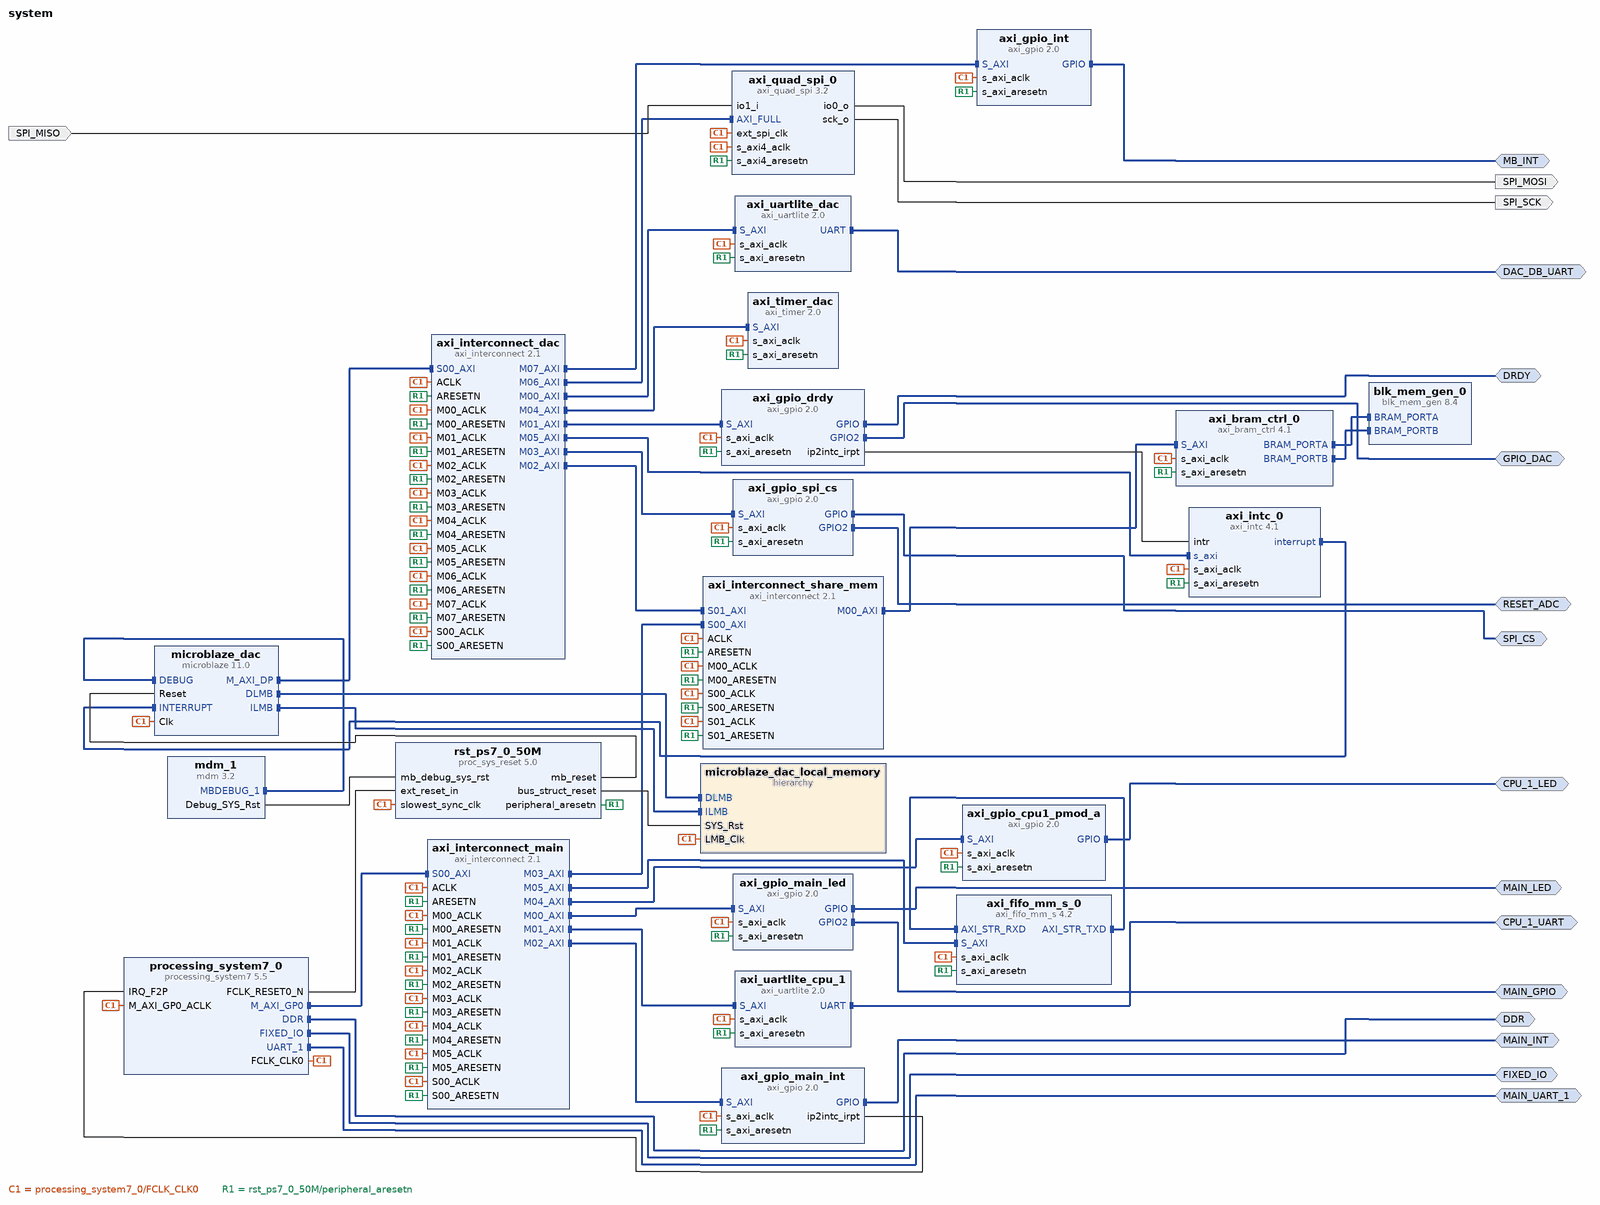
[diagram p0: block diagram of the top level]
# Vivado block design system, xc7z020clg400-1, Vivado 2022.1
create_bd_design system

create_bd_intf_port -mode Master -vlnv xilinx.com:interface:ddrx_rtl:1.0 DDR
create_bd_intf_port -mode Master -vlnv xilinx.com:display_processing_system7:fixedio_rtl:1.0 FIXED_IO
create_bd_intf_port -mode Master -vlnv xilinx.com:interface:gpio_rtl:1.0 MAIN_LED
create_bd_intf_port -mode Master -vlnv xilinx.com:interface:uart_rtl:1.0 CPU_1_UART
create_bd_intf_port -mode Master -vlnv xilinx.com:interface:uart_rtl:1.0 DAC_DB_UART
create_bd_intf_port -mode Master -vlnv xilinx.com:interface:gpio_rtl:1.0 RESET_ADC
create_bd_intf_port -mode Master -vlnv xilinx.com:interface:gpio_rtl:1.0 GPIO_DAC
create_bd_intf_port -mode Master -vlnv xilinx.com:interface:uart_rtl:1.0 MAIN_UART_1
create_bd_intf_port -mode Master -vlnv xilinx.com:interface:gpio_rtl:1.0 MAIN_GPIO
create_bd_intf_port -mode Master -vlnv xilinx.com:interface:gpio_rtl:1.0 CPU_1_LED
create_bd_intf_port -mode Master -vlnv xilinx.com:interface:gpio_rtl:1.0 SPI_CS
create_bd_intf_port -mode Master -vlnv xilinx.com:interface:gpio_rtl:1.0 DRDY
create_bd_intf_port -mode Master -vlnv xilinx.com:interface:gpio_rtl:1.0 MB_INT
create_bd_intf_port -mode Master -vlnv xilinx.com:interface:gpio_rtl:1.0 MAIN_INT
create_bd_port -dir I SPI_MISO
create_bd_port -dir O SPI_MOSI
create_bd_port -dir O SPI_SCK

create_bd_cell -type ip -vlnv xilinx.com:ip:processing_system7:5.5 processing_system7_0
set_property -dict [list \
  CONFIG.PCW_APU_PERIPHERAL_FREQMHZ 650 \
  CONFIG.PCW_CRYSTAL_PERIPHERAL_FREQMHZ 50 \
  CONFIG.PCW_ENET0_ENET0_IO {MIO 16 .. 27} \
  CONFIG.PCW_ENET0_GRP_MDIO_ENABLE 1 \
  CONFIG.PCW_ENET0_GRP_MDIO_IO {MIO 52 .. 53} \
  CONFIG.PCW_ENET0_PERIPHERAL_ENABLE 1 \
  CONFIG.PCW_EN_CLK1_PORT 1 \
  CONFIG.PCW_FCLK_CLK1_BUF TRUE \
  CONFIG.PCW_FPGA0_PERIPHERAL_FREQMHZ 100 \
  CONFIG.PCW_FPGA1_PERIPHERAL_FREQMHZ 10 \
  CONFIG.PCW_FPGA_FCLK1_ENABLE 1 \
  CONFIG.PCW_IRQ_F2P_INTR 1 \
  CONFIG.PCW_PRESET_BANK1_VOLTAGE {LVCMOS 1.8V} \
  CONFIG.PCW_QSPI_PERIPHERAL_ENABLE 0 \
  CONFIG.PCW_SD0_GRP_CD_ENABLE 1 \
  CONFIG.PCW_SD0_GRP_CD_IO {MIO 47} \
  CONFIG.PCW_SD0_GRP_WP_ENABLE 0 \
  CONFIG.PCW_SD0_PERIPHERAL_ENABLE 1 \
  CONFIG.PCW_SD0_SD0_IO {MIO 40 .. 45} \
  CONFIG.PCW_SDIO_PERIPHERAL_FREQMHZ 50 \
  CONFIG.PCW_UART0_BAUD_RATE 921600 \
  CONFIG.PCW_UART0_PERIPHERAL_ENABLE 1 \
  CONFIG.PCW_UART0_UART0_IO {MIO 14 .. 15} \
  CONFIG.PCW_UART1_BAUD_RATE 921600 \
  CONFIG.PCW_UART1_PERIPHERAL_ENABLE 1 \
  CONFIG.PCW_UART1_UART1_IO EMIO \
  CONFIG.PCW_UART_PERIPHERAL_FREQMHZ 100 \
  CONFIG.PCW_UIPARAM_DDR_BUS_WIDTH {16 Bit} \
  CONFIG.PCW_UIPARAM_DDR_FREQ_MHZ 525 \
  CONFIG.PCW_UIPARAM_DDR_PARTNO Custom \
  CONFIG.PCW_USE_FABRIC_INTERRUPT 1 \
] [get_bd_cells processing_system7_0]
# 146 more settings of processing_system7_0 are not shown: defaults, MIO pin electricals, DDR timing, and values the tool derives
create_bd_cell -type ip -vlnv xilinx.com:ip:proc_sys_reset:5.0 rst_ps7_0_50M
create_bd_cell -type ip -vlnv xilinx.com:ip:mdm:3.2 mdm_1
set_property -dict {CONFIG.C_ADDR_SIZE 32 CONFIG.C_MB_DBG_PORTS 3 CONFIG.C_M_AXI_ADDR_WIDTH 32} [get_bd_cells mdm_1]
create_bd_cell -type ip -vlnv xilinx.com:ip:axi_gpio:2.0 axi_gpio_main_led
set_property -dict [list \
  CONFIG.C_ALL_INPUTS_2 0 \
  CONFIG.C_ALL_OUTPUTS 1 \
  CONFIG.C_ALL_OUTPUTS_2 1 \
  CONFIG.C_GPIO2_WIDTH 1 \
  CONFIG.C_GPIO_WIDTH 1 \
  CONFIG.C_INTERRUPT_PRESENT 0 \
  CONFIG.C_IS_DUAL 1 \
] [get_bd_cells axi_gpio_main_led]
create_bd_cell -type ip -vlnv xilinx.com:ip:axi_interconnect:2.1 axi_interconnect_main
set_property -dict {CONFIG.NUM_MI 6 CONFIG.NUM_SI 1} [get_bd_cells axi_interconnect_main]
create_bd_cell -type ip -vlnv xilinx.com:ip:axi_gpio:2.0 axi_gpio_spi_cs
set_property -dict [list \
  CONFIG.C_ALL_INPUTS_2 0 \
  CONFIG.C_ALL_OUTPUTS 1 \
  CONFIG.C_ALL_OUTPUTS_2 1 \
  CONFIG.C_GPIO2_WIDTH 1 \
  CONFIG.C_GPIO_WIDTH 1 \
  CONFIG.C_INTERRUPT_PRESENT 0 \
  CONFIG.C_IS_DUAL 1 \
] [get_bd_cells axi_gpio_spi_cs]
create_bd_cell -type ip -vlnv xilinx.com:ip:axi_uartlite:2.0 axi_uartlite_cpu_1
set_property -dict {CONFIG.C_BAUDRATE 115200} [get_bd_cells axi_uartlite_cpu_1]
create_bd_cell -type ip -vlnv xilinx.com:ip:axi_bram_ctrl:4.1 axi_bram_ctrl_0
set_property -dict {CONFIG.SINGLE_PORT_BRAM 0} [get_bd_cells axi_bram_ctrl_0]
create_bd_cell -type ip -vlnv xilinx.com:ip:blk_mem_gen:8.4 blk_mem_gen_0
set_property -dict {CONFIG.Memory_Type True_Dual_Port_RAM} [get_bd_cells blk_mem_gen_0]
create_bd_cell -type ip -vlnv xilinx.com:ip:axi_interconnect:2.1 axi_interconnect_share_mem
set_property -dict {CONFIG.NUM_MI 1 CONFIG.NUM_SI 2} [get_bd_cells axi_interconnect_share_mem]
create_bd_cell -type ip -vlnv xilinx.com:ip:microblaze:11.0 microblaze_dac
set_property -dict [list \
  CONFIG.C_DEBUG_ENABLED 1 \
  CONFIG.C_D_AXI 1 \
  CONFIG.C_D_LMB 1 \
  CONFIG.C_ENABLE_DISCRETE_PORTS 0 \
  CONFIG.C_FSL_LINKS 0 \
  CONFIG.C_I_LMB 1 \
] [get_bd_cells microblaze_dac]
create_bd_cell -type hier microblaze_dac_local_memory
create_bd_cell -type ip -vlnv xilinx.com:ip:axi_interconnect:2.1 axi_interconnect_dac
set_property -dict {CONFIG.NUM_MI 8} [get_bd_cells axi_interconnect_dac]
create_bd_cell -type ip -vlnv xilinx.com:ip:axi_uartlite:2.0 axi_uartlite_dac
set_property -dict {CONFIG.C_BAUDRATE 115200} [get_bd_cells axi_uartlite_dac]
create_bd_cell -type ip -vlnv xilinx.com:ip:axi_gpio:2.0 axi_gpio_drdy
set_property -dict [list \
  CONFIG.C_ALL_INPUTS 1 \
  CONFIG.C_ALL_OUTPUTS_2 1 \
  CONFIG.C_GPIO2_WIDTH 1 \
  CONFIG.C_GPIO_WIDTH 1 \
  CONFIG.C_INTERRUPT_PRESENT 1 \
  CONFIG.C_IS_DUAL 1 \
] [get_bd_cells axi_gpio_drdy]
create_bd_cell -type ip -vlnv xilinx.com:ip:axi_timer:2.0 axi_timer_dac
create_bd_cell -type ip -vlnv xilinx.com:ip:axi_intc:4.1 axi_intc_0
create_bd_cell -type ip -vlnv xilinx.com:ip:axi_gpio:2.0 axi_gpio_main_int
set_property -dict [list \
  CONFIG.C_ALL_INPUTS 1 \
  CONFIG.C_GPIO_WIDTH 1 \
  CONFIG.C_INTERRUPT_PRESENT 1 \
  CONFIG.C_IS_DUAL 0 \
] [get_bd_cells axi_gpio_main_int]
create_bd_cell -type ip -vlnv xilinx.com:ip:axi_fifo_mm_s:4.2 axi_fifo_mm_s_0
set_property -dict [list \
  CONFIG.C_RX_FIFO_DEPTH 65536 \
  CONFIG.C_RX_FIFO_PE_THRESHOLD 5 \
  CONFIG.C_RX_FIFO_PF_THRESHOLD 507 \
  CONFIG.C_TX_FIFO_DEPTH 512 \
  CONFIG.C_TX_FIFO_PE_THRESHOLD 5 \
  CONFIG.C_TX_FIFO_PF_THRESHOLD 507 \
  CONFIG.C_USE_TX_CTRL 0 \
  CONFIG.C_USE_TX_DATA 1 \
] [get_bd_cells axi_fifo_mm_s_0]
create_bd_cell -type ip -vlnv xilinx.com:ip:axi_gpio:2.0 axi_gpio_cpu1_pmod_a
set_property -dict {CONFIG.C_GPIO_WIDTH 1 CONFIG.C_IS_DUAL 0} [get_bd_cells axi_gpio_cpu1_pmod_a]
create_bd_cell -type ip -vlnv xilinx.com:ip:axi_quad_spi:3.2 axi_quad_spi_0
set_property -dict [list \
  CONFIG.C_FIFO_DEPTH 256 \
  CONFIG.C_SCK_RATIO 16 \
  CONFIG.C_TYPE_OF_AXI4_INTERFACE 1 \
  CONFIG.C_USE_STARTUP 0 \
  CONFIG.FIFO_INCLUDED 1 \
] [get_bd_cells axi_quad_spi_0]
create_bd_cell -type ip -vlnv xilinx.com:ip:axi_gpio:2.0 axi_gpio_int
set_property -dict {CONFIG.C_ALL_OUTPUTS 1 CONFIG.C_GPIO_WIDTH 1} [get_bd_cells axi_gpio_int]

# ---- hierarchy /microblaze_dac_local_memory ----
current_bd_instance /microblaze_dac_local_memory
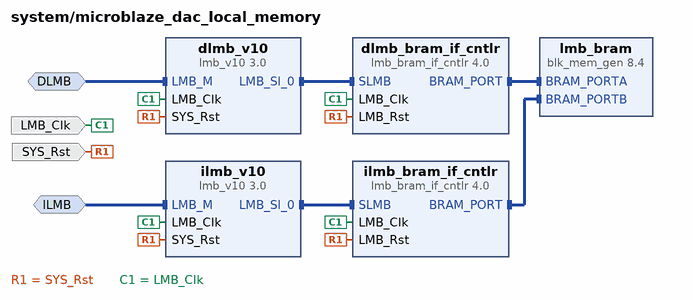
[diagram p1: block diagram inside /microblaze_dac_local_memory]
create_bd_intf_pin -mode MirroredMaster -vlnv xilinx.com:interface:lmb_rtl:1.0 DLMB
create_bd_intf_pin -mode MirroredMaster -vlnv xilinx.com:interface:lmb_rtl:1.0 ILMB
create_bd_pin -dir I -type clk LMB_Clk
create_bd_pin -dir I -type rst SYS_Rst

create_bd_cell -type ip -vlnv xilinx.com:ip:lmb_v10:3.0 dlmb_v10
create_bd_cell -type ip -vlnv xilinx.com:ip:lmb_v10:3.0 ilmb_v10
create_bd_cell -type ip -vlnv xilinx.com:ip:lmb_bram_if_cntlr:4.0 dlmb_bram_if_cntlr
set_property -dict {CONFIG.C_ECC 0} [get_bd_cells dlmb_bram_if_cntlr]
create_bd_cell -type ip -vlnv xilinx.com:ip:lmb_bram_if_cntlr:4.0 ilmb_bram_if_cntlr
set_property -dict {CONFIG.C_ECC 0} [get_bd_cells ilmb_bram_if_cntlr]
create_bd_cell -type ip -vlnv xilinx.com:ip:blk_mem_gen:8.4 lmb_bram
set_property -dict {CONFIG.Memory_Type True_Dual_Port_RAM CONFIG.use_bram_block BRAM_Controller} [get_bd_cells lmb_bram]

# ---- connections ----

current_bd_instance /microblaze_dac_local_memory
connect_bd_intf_net -intf_net microblaze_1_dlmb [get_bd_intf_pins DLMB] [get_bd_intf_pins dlmb_v10/LMB_M]
connect_bd_intf_net -intf_net microblaze_1_dlmb_bus [get_bd_intf_pins dlmb_v10/LMB_Sl_0] [get_bd_intf_pins dlmb_bram_if_cntlr/SLMB]
connect_bd_intf_net -intf_net microblaze_1_dlmb_cntlr [get_bd_intf_pins dlmb_bram_if_cntlr/BRAM_PORT] [get_bd_intf_pins lmb_bram/BRAM_PORTA]
connect_bd_intf_net -intf_net microblaze_1_ilmb [get_bd_intf_pins ILMB] [get_bd_intf_pins ilmb_v10/LMB_M]
connect_bd_intf_net -intf_net microblaze_1_ilmb_bus [get_bd_intf_pins ilmb_v10/LMB_Sl_0] [get_bd_intf_pins ilmb_bram_if_cntlr/SLMB]
connect_bd_intf_net -intf_net microblaze_1_ilmb_cntlr [get_bd_intf_pins ilmb_bram_if_cntlr/BRAM_PORT] [get_bd_intf_pins lmb_bram/BRAM_PORTB]
connect_bd_net [get_bd_pins SYS_Rst] \
  [get_bd_pins dlmb_v10/SYS_Rst] [get_bd_pins dlmb_bram_if_cntlr/LMB_Rst] [get_bd_pins ilmb_v10/SYS_Rst] \
  [get_bd_pins ilmb_bram_if_cntlr/LMB_Rst]
connect_bd_net -net microblaze_1_Clk [get_bd_pins LMB_Clk] \
  [get_bd_pins dlmb_v10/LMB_Clk] [get_bd_pins dlmb_bram_if_cntlr/LMB_Clk] [get_bd_pins ilmb_v10/LMB_Clk] \
  [get_bd_pins ilmb_bram_if_cntlr/LMB_Clk]
set_property HDL_ATTRIBUTE.BMM_INFO_ADDRESS_SPACE {byte  0x00000000 32 > system microblaze_dac_local_memory/lmb_bram} [get_bd_cells dlmb_bram_if_cntlr]
set_property HDL_ATTRIBUTE.KEEP_HIERARCHY yes [get_bd_cells dlmb_bram_if_cntlr]

current_bd_instance /
connect_bd_intf_net [get_bd_intf_pins axi_interconnect_share_mem/S01_AXI] [get_bd_intf_pins axi_interconnect_dac/M02_AXI]
connect_bd_intf_net [get_bd_intf_pins blk_mem_gen_0/BRAM_PORTA] [get_bd_intf_pins axi_bram_ctrl_0/BRAM_PORTA]
connect_bd_intf_net [get_bd_intf_pins blk_mem_gen_0/BRAM_PORTB] [get_bd_intf_pins axi_bram_ctrl_0/BRAM_PORTB]
connect_bd_intf_net [get_bd_intf_pins axi_fifo_mm_s_0/AXI_STR_TXD] [get_bd_intf_pins axi_fifo_mm_s_0/AXI_STR_RXD]
connect_bd_intf_net -intf_net axi_gpio_0_GPIO [get_bd_intf_ports MB_INT] [get_bd_intf_pins axi_gpio_int/GPIO]
connect_bd_intf_net -intf_net axi_gpio_1_GPIO [get_bd_intf_ports MAIN_LED] [get_bd_intf_pins axi_gpio_main_led/GPIO]
connect_bd_intf_net [get_bd_intf_ports CPU_1_LED] [get_bd_intf_pins axi_gpio_cpu1_pmod_a/GPIO]
connect_bd_intf_net -intf_net axi_gpio_dac_GPIO [get_bd_intf_ports DRDY] [get_bd_intf_pins axi_gpio_drdy/GPIO]
connect_bd_intf_net -intf_net axi_gpio_dac_GPIO2 [get_bd_intf_ports GPIO_DAC] [get_bd_intf_pins axi_gpio_drdy/GPIO2]
connect_bd_intf_net [get_bd_intf_ports MAIN_INT] [get_bd_intf_pins axi_gpio_main_int/GPIO]
connect_bd_intf_net [get_bd_intf_ports MAIN_GPIO] [get_bd_intf_pins axi_gpio_main_led/GPIO2]
connect_bd_intf_net -intf_net axi_gpio_pmod_GPIO [get_bd_intf_ports SPI_CS] [get_bd_intf_pins axi_gpio_spi_cs/GPIO]
connect_bd_intf_net -intf_net axi_gpio_pmod_GPIO2 [get_bd_intf_ports RESET_ADC] [get_bd_intf_pins axi_gpio_spi_cs/GPIO2]
connect_bd_intf_net [get_bd_intf_pins axi_intc_0/interrupt] [get_bd_intf_pins microblaze_dac/INTERRUPT]
connect_bd_intf_net -intf_net axi_interconnect_0_M00_AXI [get_bd_intf_pins axi_interconnect_main/M00_AXI] [get_bd_intf_pins axi_gpio_main_led/S_AXI]
connect_bd_intf_net -intf_net axi_interconnect_1_M00_AXI [get_bd_intf_pins axi_interconnect_share_mem/M00_AXI] [get_bd_intf_pins axi_bram_ctrl_0/S_AXI]
connect_bd_intf_net -intf_net axi_interconnect_1_M00_AXI1 [get_bd_intf_pins axi_uartlite_dac/S_AXI] [get_bd_intf_pins axi_interconnect_dac/M00_AXI]
connect_bd_intf_net -intf_net axi_interconnect_1_M01_AXI [get_bd_intf_pins axi_interconnect_dac/M01_AXI] [get_bd_intf_pins axi_gpio_drdy/S_AXI]
connect_bd_intf_net [get_bd_intf_pins axi_interconnect_dac/M03_AXI] [get_bd_intf_pins axi_gpio_spi_cs/S_AXI]
connect_bd_intf_net [get_bd_intf_pins axi_interconnect_dac/M04_AXI] [get_bd_intf_pins axi_timer_dac/S_AXI]
connect_bd_intf_net [get_bd_intf_pins axi_interconnect_dac/M05_AXI] [get_bd_intf_pins axi_intc_0/s_axi]
connect_bd_intf_net [get_bd_intf_pins axi_quad_spi_0/AXI_FULL] [get_bd_intf_pins axi_interconnect_dac/M06_AXI]
connect_bd_intf_net [get_bd_intf_pins axi_gpio_int/S_AXI] [get_bd_intf_pins axi_interconnect_dac/M07_AXI]
connect_bd_intf_net [get_bd_intf_pins axi_interconnect_main/M01_AXI] [get_bd_intf_pins axi_uartlite_cpu_1/S_AXI]
connect_bd_intf_net [get_bd_intf_pins axi_interconnect_main/M02_AXI] [get_bd_intf_pins axi_gpio_main_int/S_AXI]
connect_bd_intf_net [get_bd_intf_pins axi_interconnect_main/M03_AXI] [get_bd_intf_pins axi_interconnect_share_mem/S00_AXI]
connect_bd_intf_net [get_bd_intf_pins axi_interconnect_main/M04_AXI] [get_bd_intf_pins axi_gpio_cpu1_pmod_a/S_AXI]
connect_bd_intf_net [get_bd_intf_pins axi_interconnect_main/M05_AXI] [get_bd_intf_pins axi_fifo_mm_s_0/S_AXI]
connect_bd_intf_net -intf_net axi_uartlite_0_UART [get_bd_intf_ports CPU_1_UART] [get_bd_intf_pins axi_uartlite_cpu_1/UART]
connect_bd_intf_net -intf_net axi_uartlite_2_UART [get_bd_intf_ports DAC_DB_UART] [get_bd_intf_pins axi_uartlite_dac/UART]
connect_bd_intf_net -intf_net microblaze_1_M_AXI_DP [get_bd_intf_pins microblaze_dac/M_AXI_DP] [get_bd_intf_pins axi_interconnect_dac/S00_AXI]
connect_bd_intf_net -intf_net microblaze_1_debug [get_bd_intf_pins mdm_1/MBDEBUG_1] [get_bd_intf_pins microblaze_dac/DEBUG]
connect_bd_intf_net -intf_net microblaze_1_dlmb_1 [get_bd_intf_pins microblaze_dac/DLMB] [get_bd_intf_pins microblaze_dac_local_memory/DLMB]
connect_bd_intf_net -intf_net microblaze_1_ilmb_1 [get_bd_intf_pins microblaze_dac/ILMB] [get_bd_intf_pins microblaze_dac_local_memory/ILMB]
connect_bd_intf_net [get_bd_intf_ports DDR] [get_bd_intf_pins processing_system7_0/DDR]
connect_bd_intf_net [get_bd_intf_ports FIXED_IO] [get_bd_intf_pins processing_system7_0/FIXED_IO]
connect_bd_intf_net [get_bd_intf_pins processing_system7_0/M_AXI_GP0] [get_bd_intf_pins axi_interconnect_main/S00_AXI]
connect_bd_intf_net [get_bd_intf_ports MAIN_UART_1] [get_bd_intf_pins processing_system7_0/UART_1]
connect_bd_net [get_bd_ports SPI_MISO] [get_bd_pins axi_quad_spi_0/io1_i]
connect_bd_net -net axi_gpio_dac_ip2intc_irpt [get_bd_pins axi_gpio_drdy/ip2intc_irpt] [get_bd_pins axi_intc_0/intr]
connect_bd_net -net axi_gpio_i2c_led_ip2intc_irpt [get_bd_pins axi_gpio_main_int/ip2intc_irpt] [get_bd_pins processing_system7_0/IRQ_F2P]
connect_bd_net [get_bd_pins axi_quad_spi_0/io0_o] [get_bd_ports SPI_MOSI]
connect_bd_net [get_bd_pins axi_quad_spi_0/sck_o] [get_bd_ports SPI_SCK]
connect_bd_net [get_bd_pins mdm_1/Debug_SYS_Rst] [get_bd_pins rst_ps7_0_50M/mb_debug_sys_rst]
connect_bd_net -net microblaze_0_Clk [get_bd_pins processing_system7_0/FCLK_CLK0] \
  [get_bd_pins axi_bram_ctrl_0/s_axi_aclk] [get_bd_pins axi_interconnect_share_mem/M00_ACLK] \
  [get_bd_pins rst_ps7_0_50M/slowest_sync_clk] [get_bd_pins axi_gpio_main_led/s_axi_aclk] \
  [get_bd_pins axi_interconnect_main/M00_ACLK] [get_bd_pins axi_gpio_spi_cs/s_axi_aclk] \
  [get_bd_pins axi_interconnect_main/ACLK] [get_bd_pins axi_interconnect_main/S00_ACLK] \
  [get_bd_pins processing_system7_0/M_AXI_GP0_ACLK] [get_bd_pins axi_interconnect_share_mem/ACLK] \
  [get_bd_pins axi_interconnect_share_mem/S00_ACLK] [get_bd_pins axi_interconnect_share_mem/S01_ACLK] \
  [get_bd_pins axi_uartlite_cpu_1/s_axi_aclk] [get_bd_pins microblaze_dac/Clk] \
  [get_bd_pins microblaze_dac_local_memory/LMB_Clk] [get_bd_pins axi_interconnect_dac/ACLK] \
  [get_bd_pins axi_interconnect_dac/M00_ACLK] [get_bd_pins axi_uartlite_dac/s_axi_aclk] \
  [get_bd_pins axi_interconnect_dac/S00_ACLK] [get_bd_pins axi_gpio_drdy/s_axi_aclk] \
  [get_bd_pins axi_interconnect_dac/M01_ACLK] [get_bd_pins axi_interconnect_dac/M02_ACLK] \
  [get_bd_pins axi_interconnect_dac/M03_ACLK] [get_bd_pins axi_interconnect_dac/M04_ACLK] \
  [get_bd_pins axi_timer_dac/s_axi_aclk] [get_bd_pins axi_intc_0/s_axi_aclk] [get_bd_pins axi_interconnect_dac/M05_ACLK] \
  [get_bd_pins axi_interconnect_main/M01_ACLK] [get_bd_pins axi_interconnect_main/M02_ACLK] \
  [get_bd_pins axi_interconnect_main/M03_ACLK] [get_bd_pins axi_interconnect_main/M04_ACLK] \
  [get_bd_pins axi_gpio_main_int/s_axi_aclk] [get_bd_pins axi_interconnect_main/M05_ACLK] \
  [get_bd_pins axi_fifo_mm_s_0/s_axi_aclk] [get_bd_pins axi_gpio_cpu1_pmod_a/s_axi_aclk] \
  [get_bd_pins axi_interconnect_dac/M06_ACLK] [get_bd_pins axi_quad_spi_0/ext_spi_clk] [get_bd_pins axi_gpio_int/s_axi_aclk] \
  [get_bd_pins axi_interconnect_dac/M07_ACLK] [get_bd_pins axi_quad_spi_0/s_axi4_aclk]
connect_bd_net [get_bd_pins processing_system7_0/FCLK_RESET0_N] [get_bd_pins rst_ps7_0_50M/ext_reset_in]
connect_bd_net [get_bd_pins rst_ps7_0_50M/bus_struct_reset] [get_bd_pins microblaze_dac_local_memory/SYS_Rst]
connect_bd_net [get_bd_pins rst_ps7_0_50M/mb_reset] [get_bd_pins microblaze_dac/Reset]
connect_bd_net [get_bd_pins rst_ps7_0_50M/peripheral_aresetn] \
  [get_bd_pins axi_gpio_main_led/s_axi_aresetn] [get_bd_pins axi_interconnect_main/M00_ARESETN] \
  [get_bd_pins axi_interconnect_main/ARESETN] [get_bd_pins axi_interconnect_main/S00_ARESETN] \
  [get_bd_pins axi_gpio_spi_cs/s_axi_aresetn] [get_bd_pins axi_uartlite_cpu_1/s_axi_aresetn] \
  [get_bd_pins axi_bram_ctrl_0/s_axi_aresetn] [get_bd_pins axi_interconnect_share_mem/M00_ARESETN] \
  [get_bd_pins axi_interconnect_share_mem/ARESETN] [get_bd_pins axi_interconnect_share_mem/S00_ARESETN] \
  [get_bd_pins axi_interconnect_share_mem/S01_ARESETN] [get_bd_pins axi_interconnect_dac/ARESETN] \
  [get_bd_pins axi_interconnect_dac/M00_ARESETN] [get_bd_pins axi_uartlite_dac/s_axi_aresetn] \
  [get_bd_pins axi_interconnect_dac/S00_ARESETN] [get_bd_pins axi_gpio_drdy/s_axi_aresetn] \
  [get_bd_pins axi_interconnect_dac/M01_ARESETN] [get_bd_pins axi_interconnect_dac/M02_ARESETN] \
  [get_bd_pins axi_interconnect_dac/M03_ARESETN] [get_bd_pins axi_interconnect_dac/M04_ARESETN] \
  [get_bd_pins axi_timer_dac/s_axi_aresetn] [get_bd_pins axi_intc_0/s_axi_aresetn] \
  [get_bd_pins axi_interconnect_dac/M05_ARESETN] [get_bd_pins axi_interconnect_main/M01_ARESETN] \
  [get_bd_pins axi_interconnect_main/M02_ARESETN] [get_bd_pins axi_interconnect_main/M03_ARESETN] \
  [get_bd_pins axi_interconnect_main/M04_ARESETN] [get_bd_pins axi_gpio_main_int/s_axi_aresetn] \
  [get_bd_pins axi_interconnect_main/M05_ARESETN] [get_bd_pins axi_fifo_mm_s_0/s_axi_aresetn] \
  [get_bd_pins axi_gpio_cpu1_pmod_a/s_axi_aresetn] [get_bd_pins axi_interconnect_dac/M06_ARESETN] \
  [get_bd_pins axi_gpio_int/s_axi_aresetn] [get_bd_pins axi_interconnect_dac/M07_ARESETN] \
  [get_bd_pins axi_quad_spi_0/s_axi4_aresetn]
set_property HDL_ATTRIBUTE.BMM_INFO_PROCESSOR {arm > system axi_bram_ctrl_0} [get_bd_cells processing_system7_0]
set_property HDL_ATTRIBUTE.KEEP_HIERARCHY yes [get_bd_cells processing_system7_0]
set_property HDL_ATTRIBUTE.BMM_INFO_ADDRESS_SPACE {byte  0x40000000 32 > system blk_mem_gen_0} [get_bd_cells axi_bram_ctrl_0]
set_property HDL_ATTRIBUTE.KEEP_HIERARCHY yes [get_bd_cells axi_bram_ctrl_0]
set_property HDL_ATTRIBUTE.BMM_INFO_PROCESSOR {microblaze-le > system microblaze_dac_local_memory/dlmb_bram_if_cntlr system axi_bram_ctrl_0} [get_bd_cells microblaze_dac]
set_property HDL_ATTRIBUTE.KEEP_HIERARCHY yes [get_bd_cells microblaze_dac]

# ---- address map ----
assign_bd_address -offset 0x00000000 -range 64K -target_address_space [get_bd_addr_spaces microblaze_dac/Data] [get_bd_addr_segs microblaze_dac_local_memory/dlmb_bram_if_cntlr/SLMB/Mem]
assign_bd_address -offset 0x40000000 -range 16K -target_address_space [get_bd_addr_spaces microblaze_dac/Data] [get_bd_addr_segs axi_bram_ctrl_0/S_AXI/Mem0]
assign_bd_address -offset 0x40010000 -range 64K -target_address_space [get_bd_addr_spaces microblaze_dac/Data] [get_bd_addr_segs axi_gpio_drdy/S_AXI/Reg]
assign_bd_address -offset 0x40020000 -range 64K -target_address_space [get_bd_addr_spaces microblaze_dac/Data] [get_bd_addr_segs axi_gpio_spi_cs/S_AXI/Reg]
assign_bd_address -offset 0x40030000 -range 64K -target_address_space [get_bd_addr_spaces microblaze_dac/Data] [get_bd_addr_segs axi_gpio_int/S_AXI/Reg]
assign_bd_address -offset 0x40600000 -range 64K -target_address_space [get_bd_addr_spaces microblaze_dac/Data] [get_bd_addr_segs axi_uartlite_dac/S_AXI/Reg]
assign_bd_address -offset 0x41210000 -range 64K -target_address_space [get_bd_addr_spaces microblaze_dac/Data] [get_bd_addr_segs axi_intc_0/S_AXI/Reg]
assign_bd_address -offset 0x41C00000 -range 64K -target_address_space [get_bd_addr_spaces microblaze_dac/Data] [get_bd_addr_segs axi_timer_dac/S_AXI/Reg]
assign_bd_address -offset 0x44A00000 -range 64K -target_address_space [get_bd_addr_spaces microblaze_dac/Data] [get_bd_addr_segs axi_quad_spi_0/aximm/MEM0]
assign_bd_address -offset 0x00000000 -range 64K -target_address_space [get_bd_addr_spaces microblaze_dac/Instruction] [get_bd_addr_segs microblaze_dac_local_memory/ilmb_bram_if_cntlr/SLMB/Mem]
assign_bd_address -offset 0x40000000 -range 64K -target_address_space [get_bd_addr_spaces processing_system7_0/Data] [get_bd_addr_segs axi_bram_ctrl_0/S_AXI/Mem0]
assign_bd_address -offset 0x41200000 -range 64K -target_address_space [get_bd_addr_spaces processing_system7_0/Data] [get_bd_addr_segs axi_gpio_main_led/S_AXI/Reg]
assign_bd_address -offset 0x41220000 -range 64K -target_address_space [get_bd_addr_spaces processing_system7_0/Data] [get_bd_addr_segs axi_gpio_cpu1_pmod_a/S_AXI/Reg]
assign_bd_address -offset 0x41230000 -range 64K -target_address_space [get_bd_addr_spaces processing_system7_0/Data] [get_bd_addr_segs axi_gpio_main_int/S_AXI/Reg]
assign_bd_address -offset 0x42C00000 -range 64K -target_address_space [get_bd_addr_spaces processing_system7_0/Data] [get_bd_addr_segs axi_uartlite_cpu_1/S_AXI/Reg]
assign_bd_address -offset 0x43C10000 -range 64K -target_address_space [get_bd_addr_spaces processing_system7_0/Data] [get_bd_addr_segs axi_fifo_mm_s_0/S_AXI/Mem0]

validate_bd_design
save_bd_design
